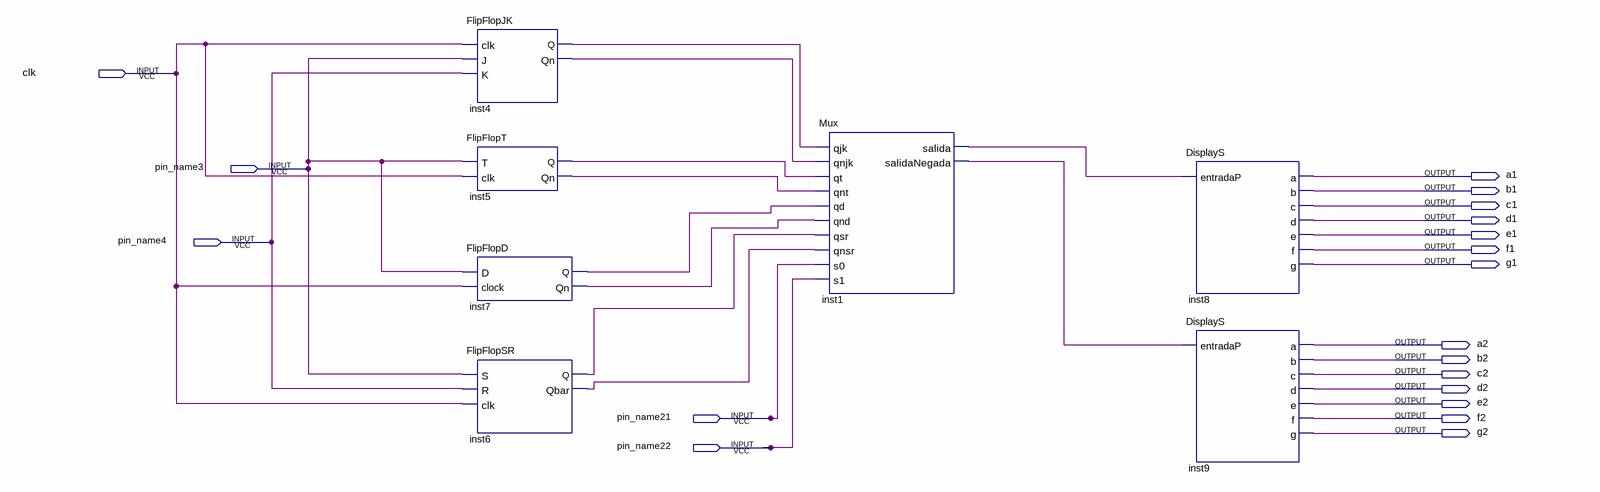
[diagram p0: schematic sheet]
// Quartus schematic Practica1.bdf as structural Verilog: 7 symbols, 19 pins
module Practica1 (
  input  clk,
  input  pin_name3,
  input  pin_name4,
  input  pin_name21,
  input  pin_name22,
  output a1,
  output b1,
  output c1,
  output d1,
  output e1,
  output f1,
  output g1,
  output a2,
  output b2,
  output c2,
  output d2,
  output e2,
  output f2,
  output g2
);

  wire inst1_salida, inst1_salidanegada, inst4_q, inst4_qn, inst5_q, inst5_qn, inst6_q, inst6_qbar, inst7_q,
       inst7_qn;

  FlipFlopJK inst4 (.clk(clk), .J(pin_name3), .K(pin_name4), .Q(inst4_q), .Qn(inst4_qn));
  FlipFlopT inst5 (.T(pin_name3), .clk(clk), .Q(inst5_q), .Qn(inst5_qn));
  FlipFlopD inst7 (.D(pin_name3), .clock(clk), .Q(inst7_q), .Qn(inst7_qn));
  FlipFlopSR inst6 (.S(pin_name3), .R(pin_name4), .clk(clk), .Q(inst6_q), .Qbar(inst6_qbar));
  Mux inst1 (
    .qjk(inst4_q), .qnjk(inst4_qn), .qt(inst5_q), .qnt(inst5_qn), .qd(inst7_q), .qnd(inst7_qn),
    .qsr(inst6_q), .qnsr(inst6_qbar), .s0(pin_name21), .s1(pin_name22), .salida(inst1_salida),
    .salidaNegada(inst1_salidanegada));
  DisplayS inst8 (.entradaP(inst1_salida), .a(a1), .b(b1), .c(c1), .d(d1), .e(e1), .f(f1), .g(g1));
  DisplayS inst9 (.entradaP(inst1_salidanegada), .a(a2), .b(b2), .c(c2), .d(d2), .e(e2), .f(f2), .g(g2));
endmodule
